# EAGLE design WearableMetronome (EAGLE 9.3.0)
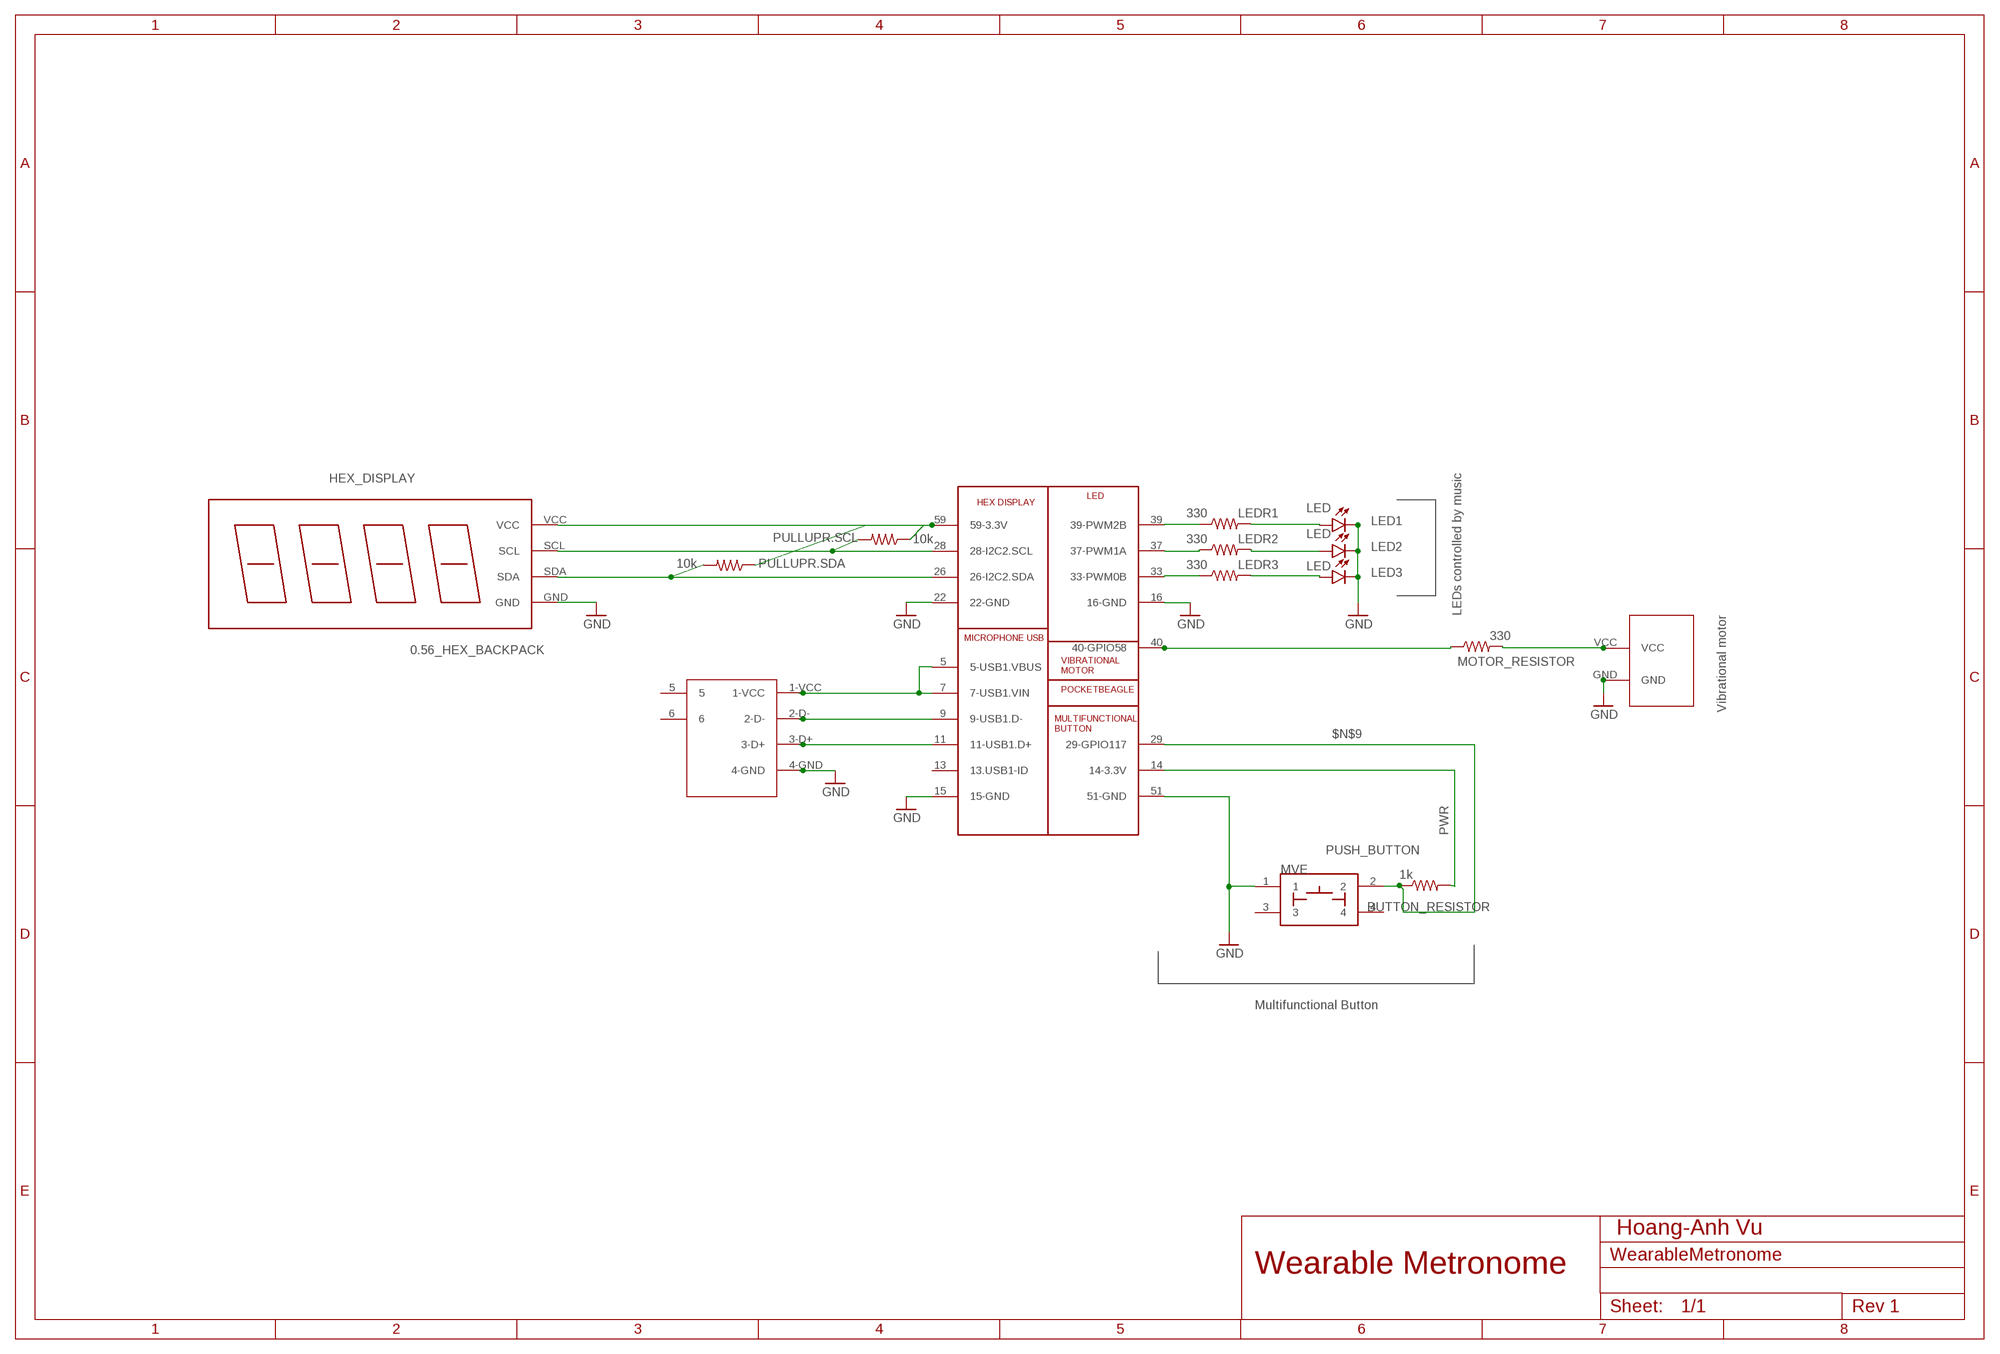
[diagram p0: schematic, sheet 1]

## Parts
BUTTON_RESISTOR  1k  R_R0603  [R0603]
HEX_DISPLAY  0.56_HEX_BACKPACK  [0.56_HEX_BACKPACK]
LED1  LED  [EIA-STD]
LED2  LED  [EIA-STD]
LED3  LED  [EIA-STD]
LEDR1  330  R_R0603  [R0603]
LEDR2  330  R_R0603  [R0603]
LEDR3  330  R_R0603  [R0603]
MOTOR_RESISTOR  330  R_R0603  [R0603]
MVE  PUSH_BUTTON  [BUTTON_12.5MM]
PULLUPR.SCL  10k  R_R0603  [R0603]
PULLUPR.SDA  10k  R_R0603  [R0603]
U$1  USBAFEMALE  [USBAFEMALE]
U$2  VIBRATIONALMOTOR  [VIBRATIONALMOTOR]
U$3  POCKETBEAGLE_HOANG  [POCKETBEAGLE_HOANG]

## Nets
$N$9: BUTTON_RESISTOR.1 MVE.2 U$3.29(29-GPIO117)
GND: HEX_DISPLAY.GND LED1.P$2(C) LED2.P$2(C) LED3.P$2(C) MVE.1 U$1.4-GND U$2.GND U$3.15(15-GND) U$3.16(16-GND) U$3.22(22-GND) U$3.51(51-GND)
N$2: HEX_DISPLAY.SCL PULLUPR.SCL.2 U$3.28(28-I2C2.SCL)
N$3: HEX_DISPLAY.SDA PULLUPR.SDA.2 U$3.26(26-I2C2.SDA)
N$4: MOTOR_RESISTOR.2 U$2.VCC
N$5: U$1.1-VCC U$3.5(5-USB1.VBUS) U$3.7(7-USB1.VIN)
N$6: U$1.2-D- U$3.9(9-USB1.D-)
N$7: U$1.3-D+ U$3.11(11-USB1.D+)
N$14: MOTOR_RESISTOR.1 U$3.40(40-GPIO58)
N$16: LEDR3.1 U$3.33(33-PWM0B)
N$17: LEDR1.1 U$3.39(39-PWM2B)
N$18: LED1.P$1(A) LEDR1.2
N$19: LEDR2.1 U$3.37(37-PWM1A)
N$20: LED2.P$1(A) LEDR2.2
N$21: LED3.P$1(A) LEDR3.2
PWR: BUTTON_RESISTOR.2 HEX_DISPLAY.VCC PULLUPR.SCL.1 PULLUPR.SDA.1 U$3.14(14-3.3V) U$3.59(59-3.3V)
Unconnected: MVE.3 MVE.4 U$1.5 U$1.6 U$3.13(13.USB1-ID)

## Notes on the sheet
- LEDs controlled by music
- Vibrational motor
- Multifunctional Button
- Hoang-Anh Vu
- Wearable Metronome
- 1/1

## Library data of the parts
BUTTON_RESISTOR LEDR1-LEDR3 MOTOR_RESISTOR PULLUPR.SCL PULLUPR.SDA = ENGI301:R_: RESISTOR, American symbol
HEX_DISPLAY = WearableMetronome:0.56_HEX_BACKPACK: 0.56" LED HEX Backback - Adafruit HT16K33 - https://www.adafruit.com/product/878 - https://www.adafruit.com/product/879 - https://www.adafruit.com/product/880 - https://www.adafruit.com/product/881 - https://www.adafruit.com/product/1002
LED1-LED3 = ENGI301:LED: LTST-C191TBKT Series of LEDs
MVE = WearableMetronome:PUSH_BUTTON
U$1 = WearableMetronome:USBAFEMALE
U$2 = WearableMetronome:VIBRATIONALMOTOR
U$3 = WearableMetronome:POCKETBEAGLE_HOANG

## Board
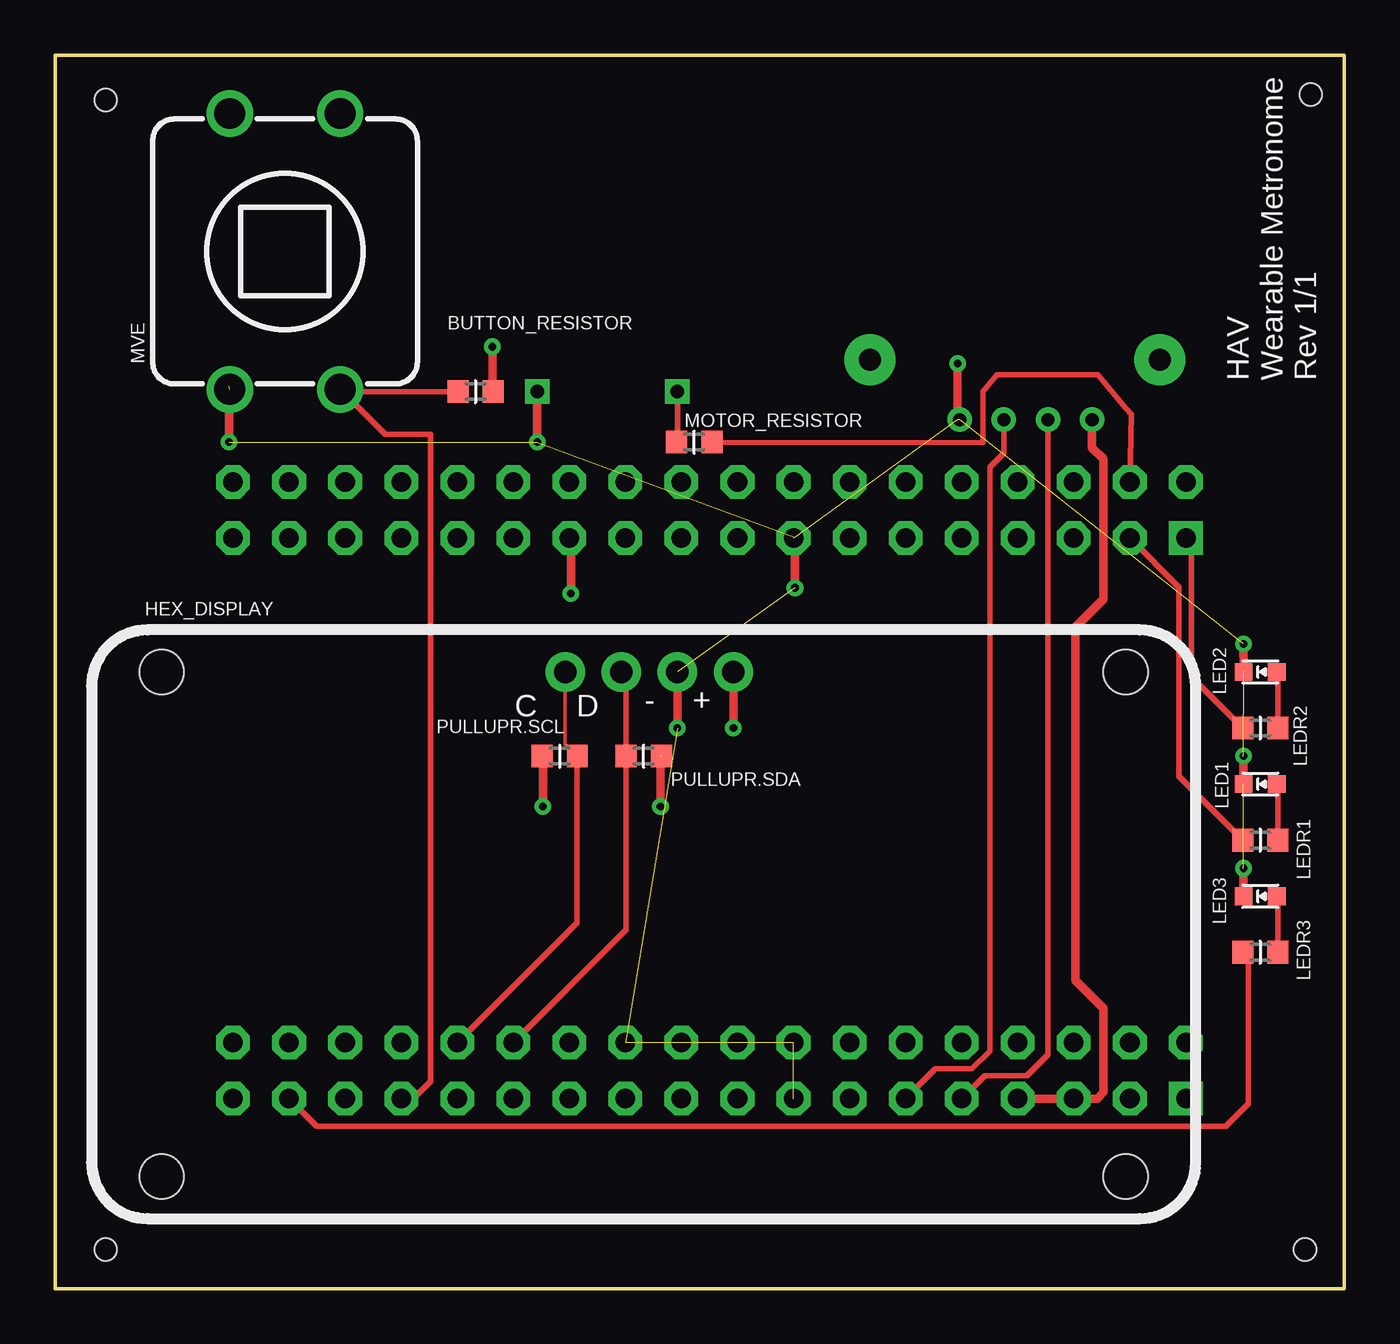
[diagram p1: board, top side]
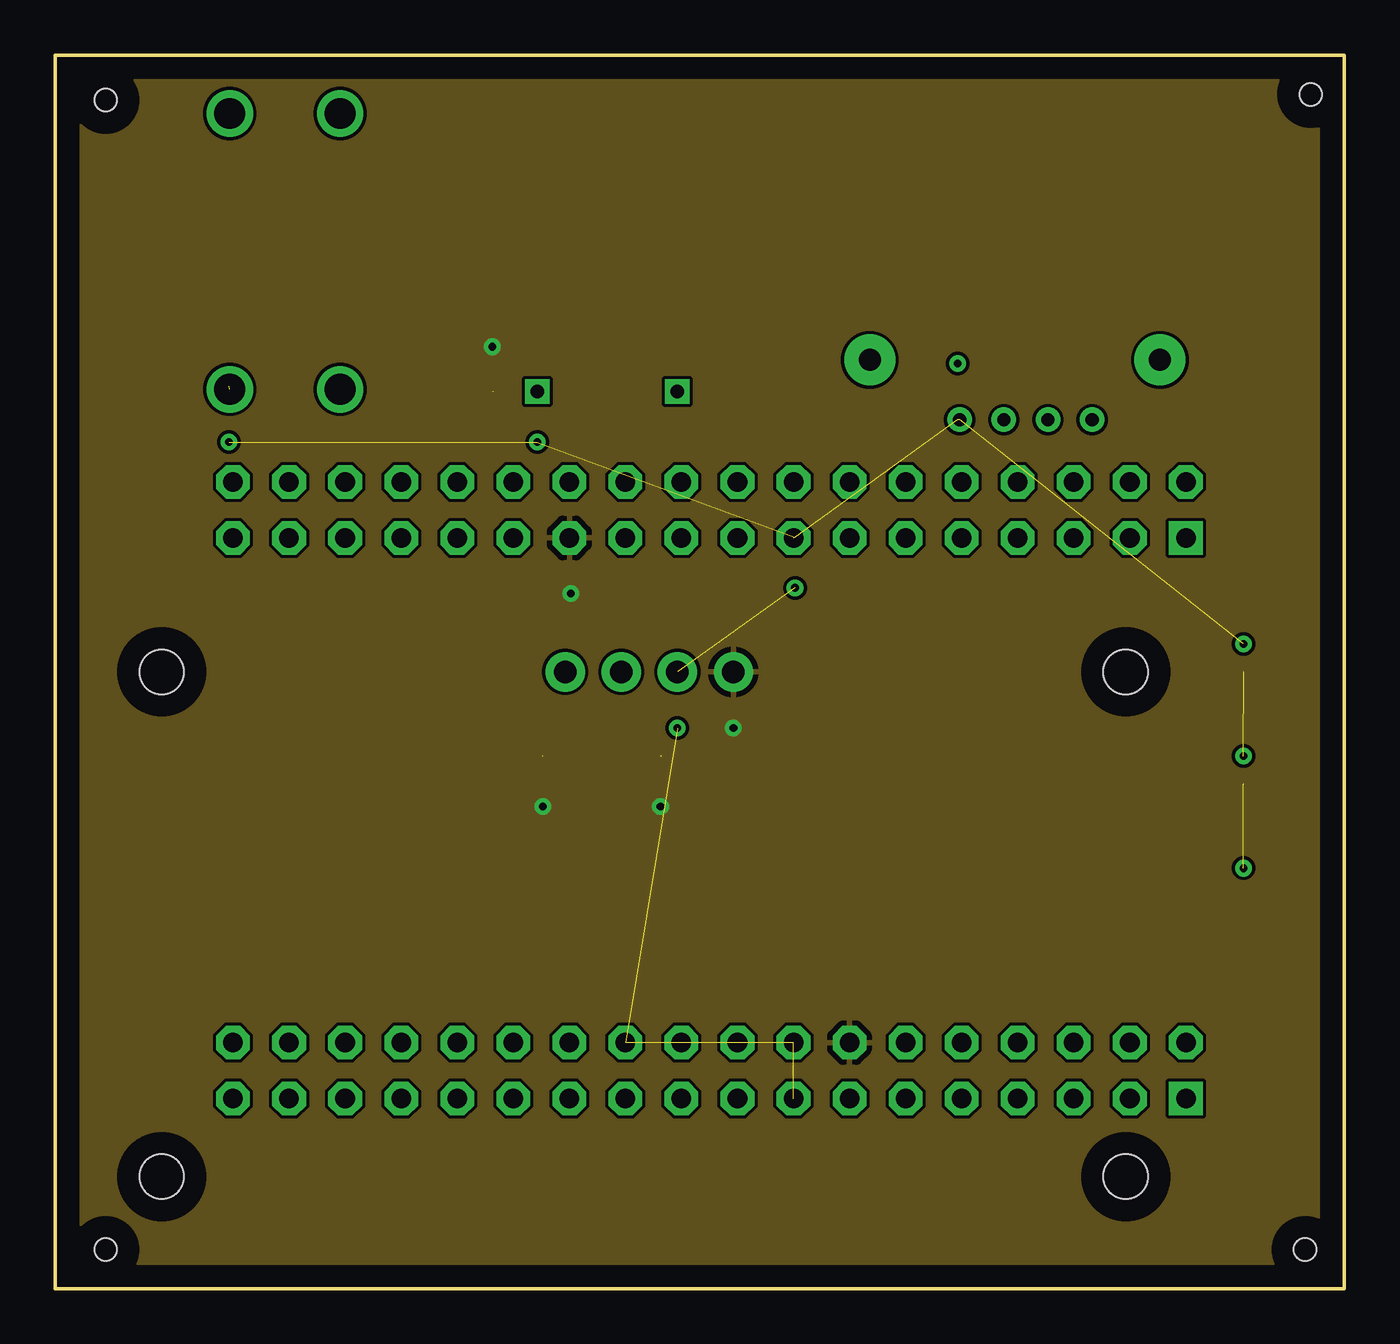
[diagram p2: board, inner layer Route2]
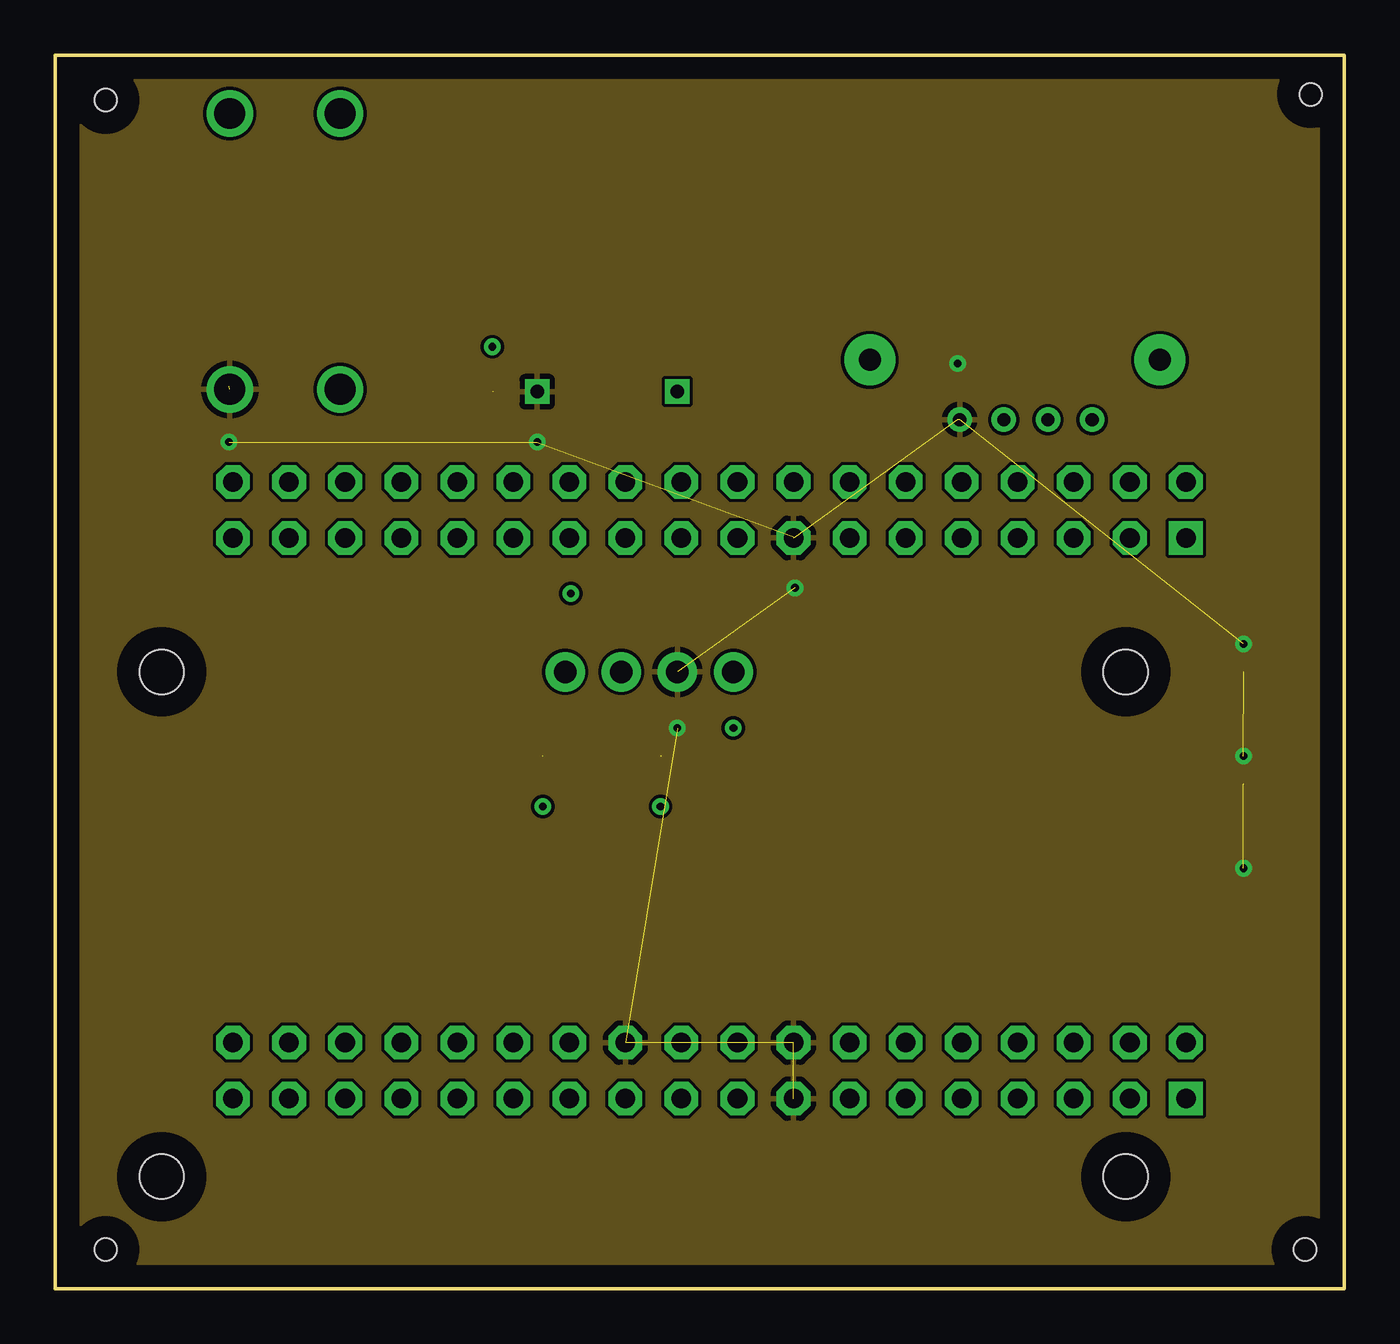
[diagram p3: board, inner layer Route15]
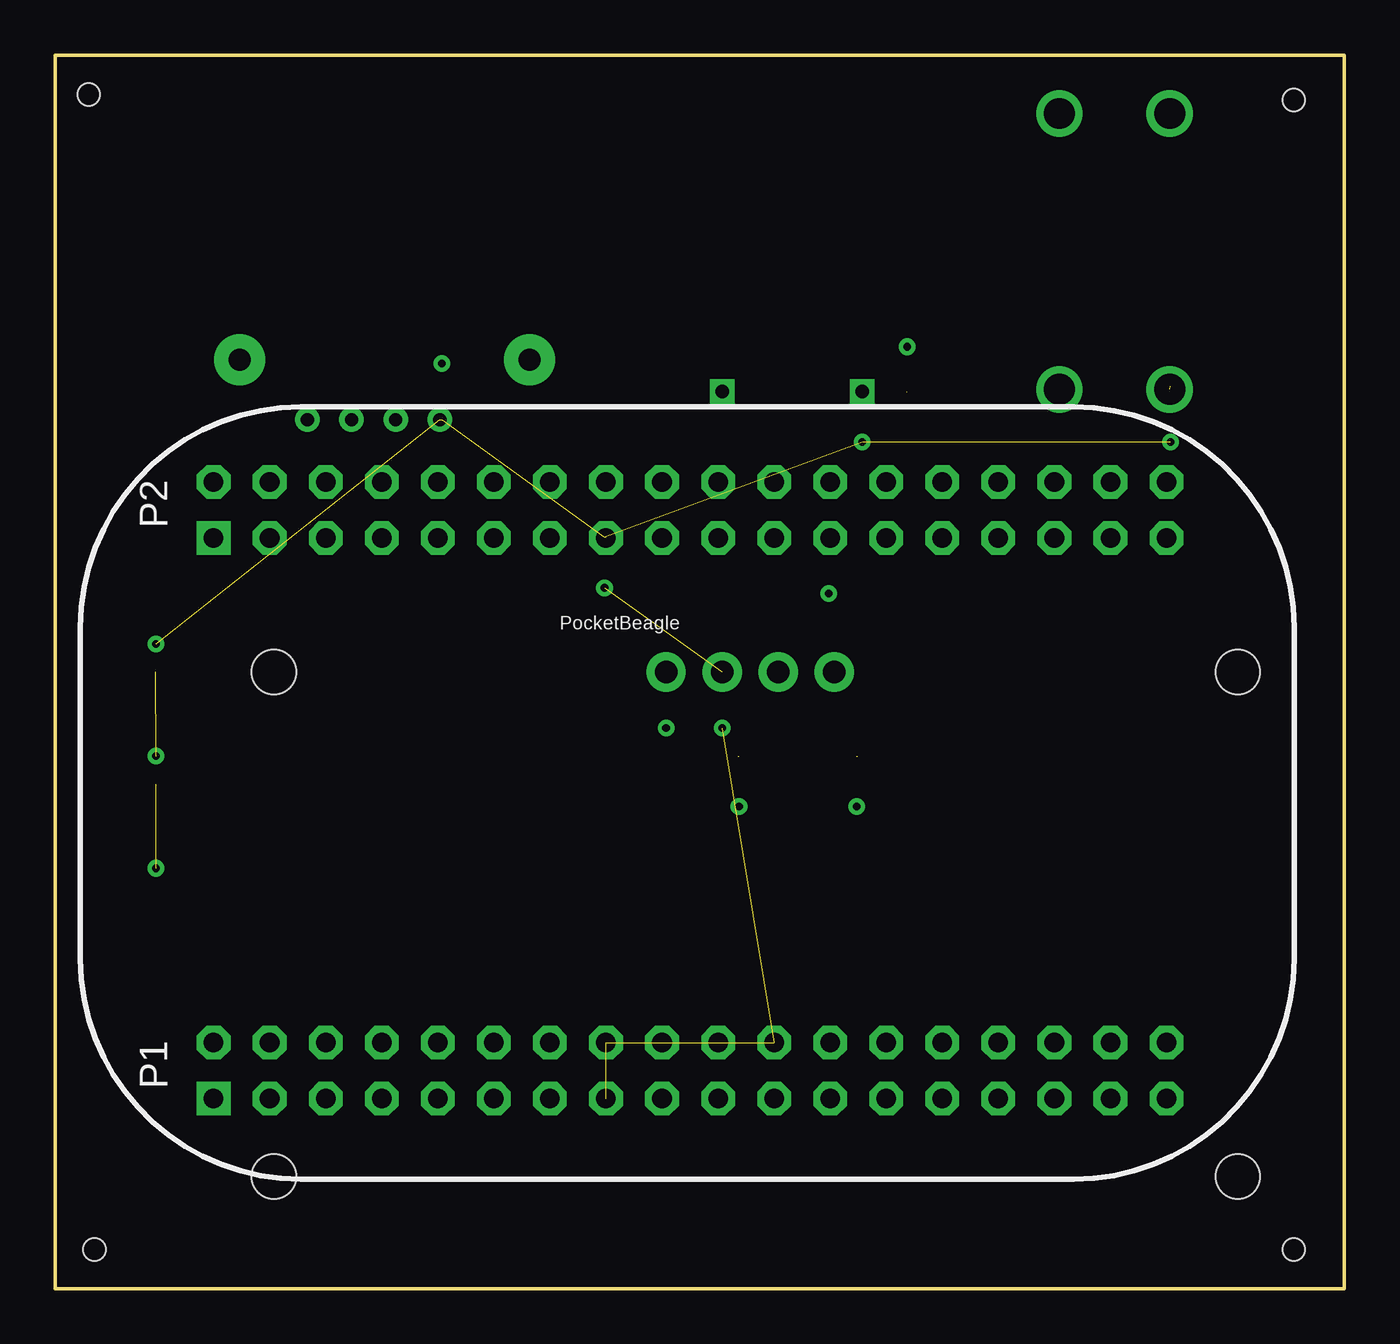
[diagram p4: board, bottom side, seen from below]

Size 58.42 x 55.88 mm. Coordinates in mm from the lower left corner, seen from the top.
Outline: 0,0 58.42,0 58.42,55.88 0,55.88 0,0
Copper layers (1*16): Top 0.035mm / dielectric 1.5mm / Bottom 0.035mm
Design rules "default": minimum track width 6mil, minimum drill 0.35mm, track to track 6mil, track to pad 6mil, pad to pad 6mil, via to via 6mil, smd to smd 6mil, copper to edge 40mil, drill to drill 6mil, minimum pad ring 10mil, minimum via ring 8mil, stop-mask expansion 4mil, vias tented up to drill 0mil, thermal gap 10mil
Holes 1 mm at 2.29,53.85 56.9,54.1 2.29,1.78 56.64,1.78

### Footprints (pad centres in the part's own frame; a part is rotated, then mirrored left to right if it is on the bottom)
R0603 = smd 0.95 x 1.031: 1 -0.8,0; 2 0.8,0
0.56_HEX_BACKPACK = drill 1.016 pad 1.778: GND 1.524,11.43; SCL -3.556,11.43; SDA -1.016,11.43; VCC 4.064,11.43 | hole 2: -21.844,-11.43; 21.844,-11.43; -21.844,11.43; 21.844,11.43
EIA-STD = smd 0.8 x 0.8: P$1 -0.75,0; P$2 0.75,0
BUTTON_12.5MM = drill 1.4: 1 -6.25,2.5; 2 -6.25,-2.5; 3 6.25,2.5; 4 6.25,-2.5
USBAFEMALE = drill 0.6 pad 0.92: 1-VCC 0,0; 2-D- 2,0; 3-D+ 4,0; 4-GND 6,0 | drill 1 pad 2.3: 5 -3.07,-2.71; 6 10.07,-2.71
VIBRATIONALMOTOR = drill 0.6 square: GND 15.24,1.27; VCC 15.24,7.62
POCKETBEAGLE_HOANG = drill 0.889 pad 1.524 square: 1 5.91,3.53; 37 5.91,28.93 | drill 0.889 pad 1.524 octagon: 2 5.91,6.07; 3 8.45,3.53; 4 8.45,6.07; 5 10.99,3.53; 6 10.99,6.07; 7 13.53,3.53; 8 13.53,6.07; 9 16.07,3.53; 10 16.07,6.07; 11 18.61,3.53; 12 18.61,6.07; 13 21.15,3.53; 14 21.15,6.07; 15 23.69,3.53; 16 23.69,6.07; 17 26.23,3.53; 18 26.23,6.07; 19 28.77,3.53; 20 28.77,6.07; 21 31.31,3.53; 22 31.31,6.07; 23 33.85,3.53; 24 33.85,6.07; 25 36.39,3.53; 26 36.39,6.07; 27 38.93,3.53; 28 38.93,6.07; 29 41.47,3.53; 30 41.47,6.07; 31 44.01,3.53; 32 44.01,6.07; 33 46.55,3.53; 34 46.55,6.07; 35 49.09,3.53; 36 49.09,6.07; 38 5.91,31.47; 39 8.45,28.93; 40 8.45,31.47; 41 10.99,28.93; 42 10.99,31.47; 43 13.53,28.93; 44 13.53,31.47; 45 16.07,28.93; 46 16.07,31.47; 47 18.61,28.93; 48 18.61,31.47; 49 21.15,28.93; 50 21.15,31.47; 51 23.69,28.93; 52 23.69,31.47; 53 26.23,28.93; 54 26.23,31.47; 55 28.77,28.93; 56 28.77,31.47; 57 31.31,28.93; 58 31.31,31.47; 59 33.85,28.93; 60 33.85,31.47; 61 36.39,28.93; 62 36.39,31.47; 63 38.93,28.93; 64 38.93,31.47; 65 41.47,28.93; 66 41.47,31.47; 67 44.01,28.93; 68 44.01,31.47; 69 46.55,28.93; 70 46.55,31.47; 71 49.09,28.93; 72 49.09,31.47

### Placement (x,y rotation side)
BUTTON_RESISTOR  19.05,40.64 0 top
HEX_DISPLAY  26.67,16.51 0 top
LED1  54.61,22.86 180 top
LED2  54.61,27.94 180 top
LED3  54.61,17.78 180 top
LEDR1  54.61,20.32 0 top
LEDR2  54.61,25.4 0 top
LEDR3  54.61,15.24 0 top
MOTOR_RESISTOR  28.96,38.35 180 top
MVE  10.41,46.99 90 top
PULLUPR.SCL  22.86,24.13 0 top
PULLUPR.SDA  26.67,24.13 180 top
U$1  46.99,39.37 180 top
U$2  20.57,55.88 270 top
U$3  57.15,5.08 0 bottom

### Tracks (layer width: path | path; a pad name or v marks a point on that pad's centre or on a via)
$N$9
  Top 0.152: MVE.2 13.01,40.64
  Top 0.254: 13.01,40.64 BUTTON_RESISTOR.1 | MVE.2 14.95,38.71 17.02,38.71 17.02,9.4 16.23,8.61 U$3.29
GND  (via drill 0.35)  (14 unrouted)
  Top 0.152: LED3.P$2 53.85,17.79
  Top 0.381: v53.85,29.21 LED2.P$2 | v53.85,24.13 53.85,22.86 | 53.85,17.79 v53.85,19.05 | v28.19,25.4 HEX_DISPLAY.GND | v40.89,41.91 40.89,39.37 | v33.53,31.75 33.53,34.04 | v7.87,38.35 7.87,40.89 | v21.84,38.35 U$2.GND
  pour Route15: -7.62,62.23 63.5,62.23 63.5,-6.35 -7.62,-6.35
N$2
  Top 0.152: HEX_DISPLAY.SCL 23.11,24.68 PULLUPR.SCL.2
  Top 0.254: U$3.28 23.66,16.59 PULLUPR.SCL.2
N$3
  Top 0.254: U$3.26 25.87,16.26 PULLUPR.SDA.2 25.87,27.72 HEX_DISPLAY.SDA
N$4
  Top 0.152: MOTOR_RESISTOR.2 28.19,38.39
  Top 0.254: 28.19,38.39 U$2.VCC
N$5
  Top 0.381: U$3.7 U$3.5 47.22,8.61 47.5,8.89 47.5,12.7 46.23,13.97 46.23,29.97 47.5,31.24 47.5,37.59 46.99,38.1 U$1.1-VCC
N$6
  Top 0.254: U$1.2-D- 44.99,10.61 44.03,9.65 42.12,9.65 U$3.9
N$7
  Top 0.254: U$1.3-D+ 42.99,37.85 42.35,37.21 42.35,10.76 41.54,9.96 39.89,9.96 U$3.11
N$14
  Top 0.152: 42.03,40.64 42.03,40.66
  Top 0.254: MOTOR_RESISTOR.1 42.03,38.31 42.03,40.64 42.67,41.4 47.24,41.4 48.51,39.88 48.77,39.62 U$3.40
N$16
  Top 0.254: U$3.33 11.84,7.37 53.05,7.37 54.06,8.38 54.06,14.99 LEDR3.1
N$17
  Top 0.254: U$3.39 50.92,31.79 50.92,23.2 LEDR1.1
N$18
  Top 0.152: LED1.P$1 55.41,22.81
  Top 0.254: 55.41,22.81 LEDR1.2
N$19
  Top 0.254: U$3.37 51.49,33.76 51.49,27.72 LEDR2.1
N$20
  Top 0.152: LED2.P$1 55.41,27.89
  Top 0.254: 55.41,27.89 LEDR2.2
N$21
  Top 0.152: LED3.P$1 55.41,17.73
  Top 0.254: 55.41,17.73 LEDR3.2
PWR  (via drill 0.35)  (3 unrouted)
  Top 0.152: 22,24.19 PULLUPR.SCL.1 | BUTTON_RESISTOR.2 19.81,40.68
  Top 0.381: v30.73,25.4 HEX_DISPLAY.VCC | v22.1,21.84 22.1,24.13 | v27.43,21.84 27.43,24.13 | v19.81,42.67 19.81,40.64 | v23.37,31.5 23.37,34.04
  pour Route2: -5.08,59.69 60.96,59.69 60.96,-3.81 -5.08,-3.81

### Text on the board
tNames: HAV / Wearable Metronome / Rev 1/1